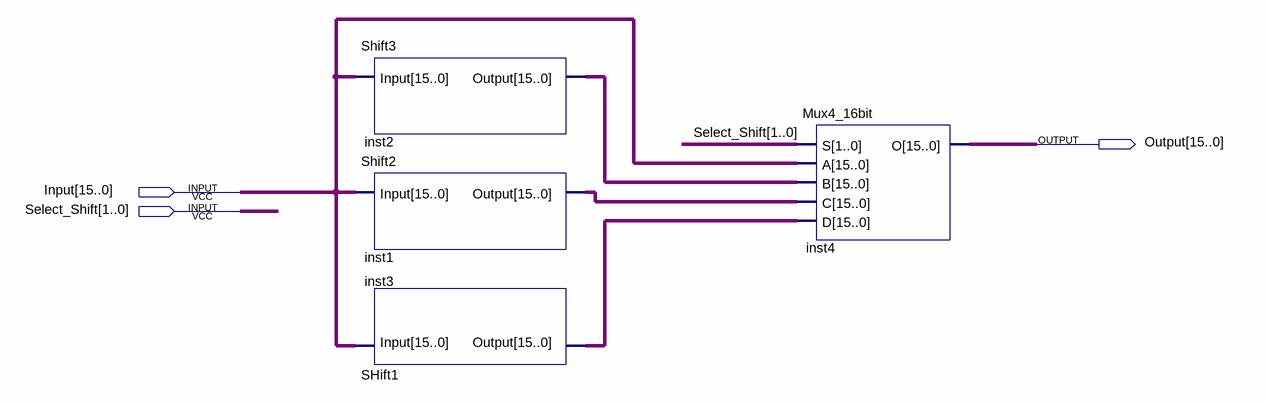
[diagram p0: schematic sheet]
// Quartus schematic Final_Shift_Design.bdf as structural Verilog: 4 symbols, 3 pins
module Final_Shift_Design (
  input  [15:0] Input,
  input  [1:0] Select_Shift,
  output [15:0] Output
);

  wire [15:0] inst1_output, inst2_output, inst3_output;

  Shift3 inst2 (.Input(Input), .Output(inst2_output));
  Shift2 inst1 (.Input(Input), .Output(inst1_output));
  SHift1 inst3 (.Input(Input), .Output(inst3_output));
  Mux4_16bit inst4 (.S(Select_Shift), .A(Input), .B(inst2_output), .C(inst1_output), .D(inst3_output), .O(Output));
endmodule
